# EAGLE design FLEXIBOARD (EAGLE 7.6.0)
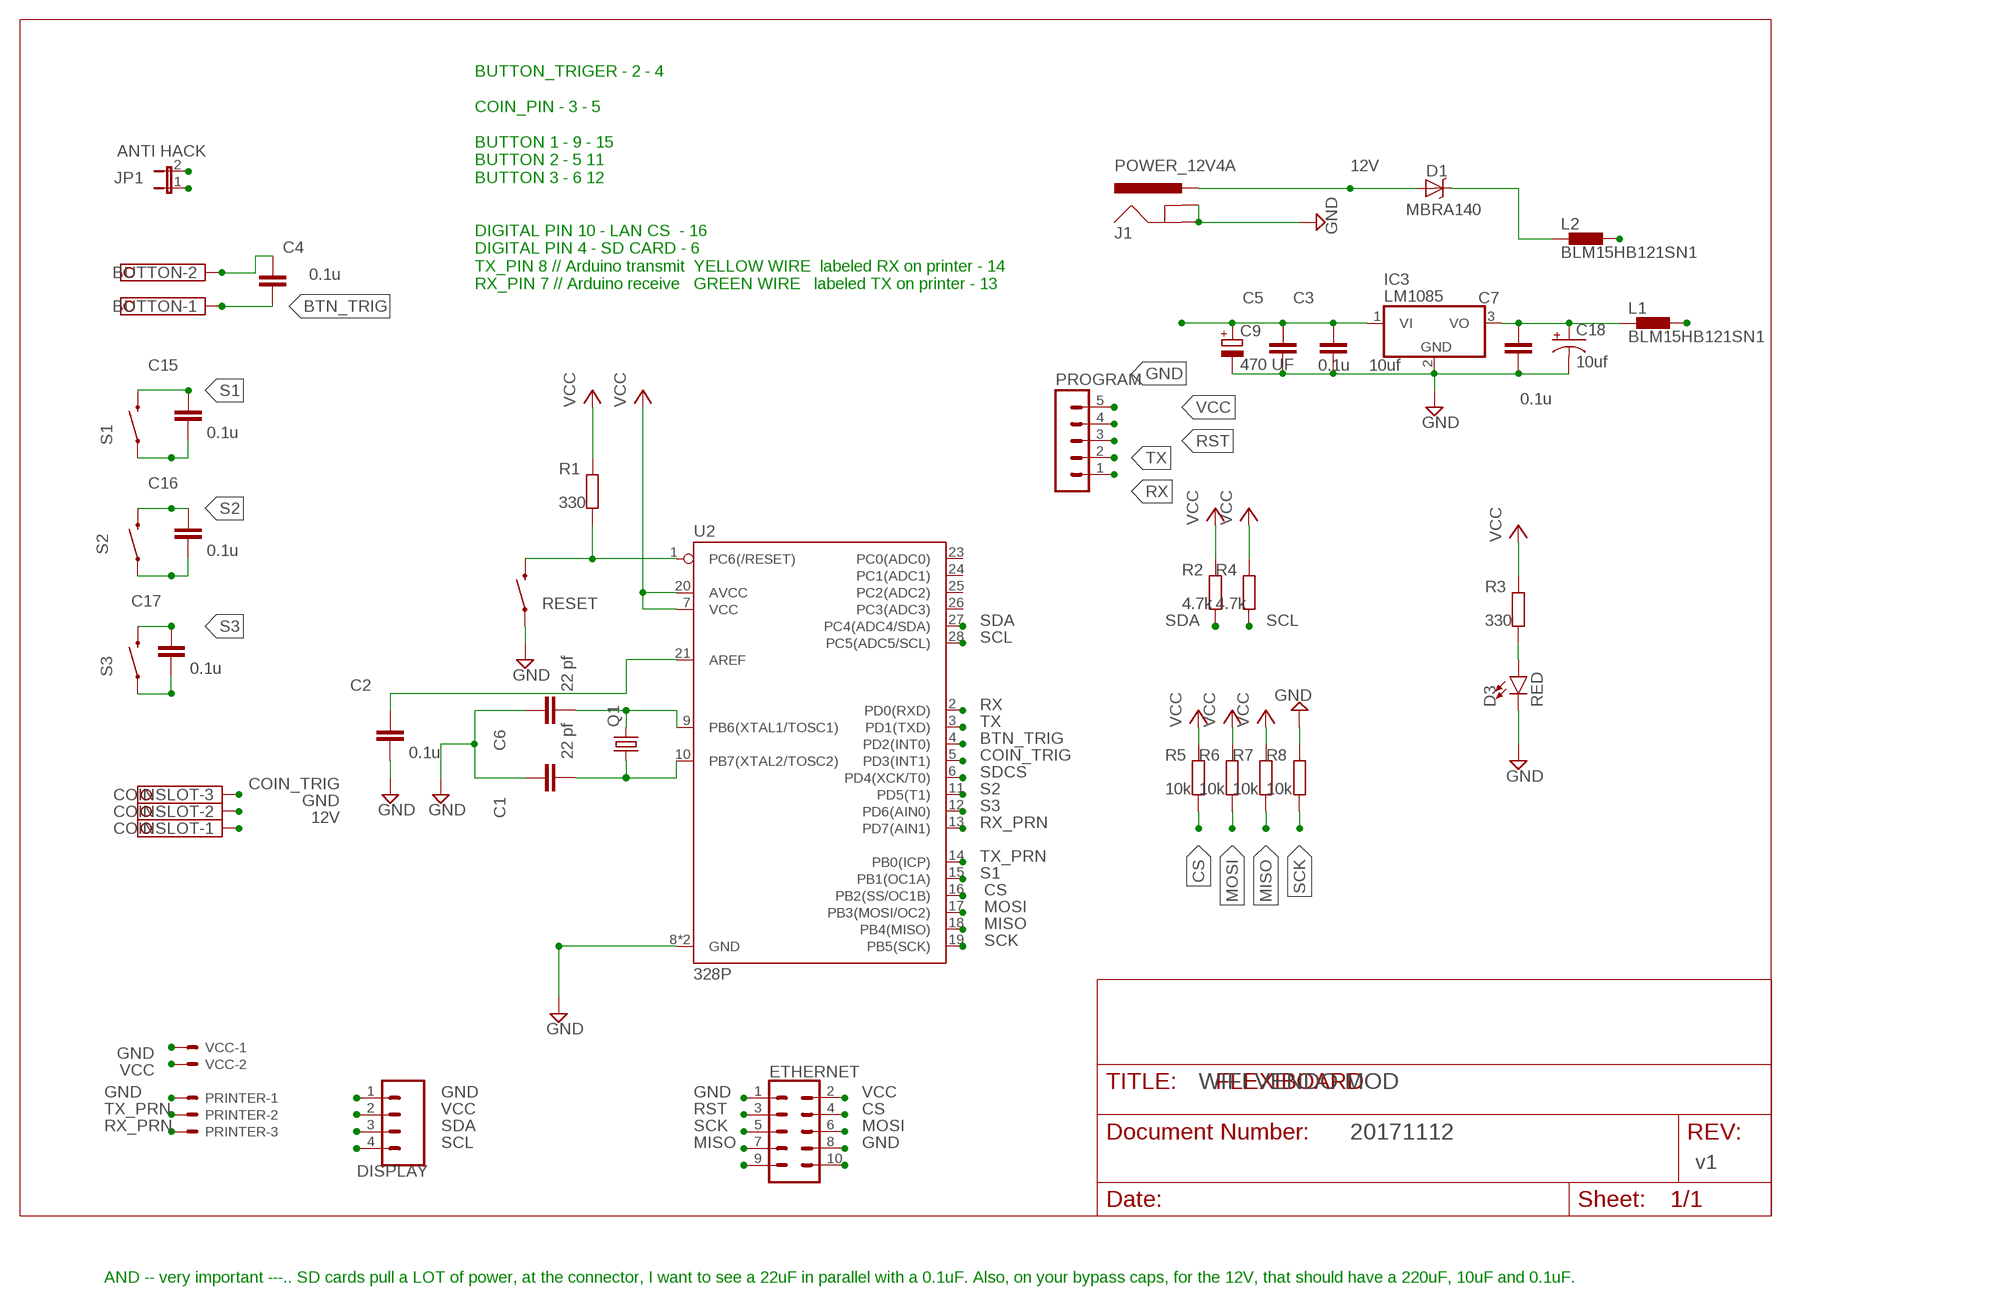
[diagram p0: schematic, sheet 1]

## Parts
BUTTON  TERMINAL-BLOCK-3.5MM-2-PIN-LONG-PAD  [TERMINAL-BLOCK-2-PIN-3.5MM-LONG-PAD]
C1  22 pf  C-EU050-024X044  [C050-024X044]
C2  0.1u  C-EU050-024X044  [C050-024X044]
C3  10uf  C-EU050-024X044  [C050-024X044]
C4  0.1u  C-EU050-024X044  [C050-024X044]
C5  0.1u  C-EU050-024X044  [C050-024X044]
C6  22 pf  C-EU050-024X044  [C050-024X044]
C7  0.1u  C-EU050-024X044  [C050-024X044]
C9  470 UF  CPOL-EUE2.5-7  [E2,5-7]
C15  0.1u  C-EU050-024X044  [C050-024X044]
C16  0.1u  C-EU050-024X044  [C050-024X044]
C17  0.1u  C-EU050-024X044  [C050-024X044]
C18  10uf  CPOL-USE2-5  [E2-5]
COINSLOT  TERMINAL-BLOCK-3.5MM-3-PIN-LONG-PAD  [TERMINAL-BLOCK-3-PIN-3.5MM-LONG-PAD]
D1  MBRA140  DIODE-SCHOTTKY_  [SMA-DIODE]
D3  RED  LED5MM  [LED_5MM]
DISPLAY  M04PTH  [1X04]
ETHERNET  CONN_05X2PTH  [2X5]
IC3  LM1085  LM2937  [TO263-3]
J1  POWER_12V4A  POWER_JACKPTH  [POWER_JACK_PTH]
JP1  ANTI HACK  JUMPER-2SMD-NO  [SJ_2S-NO]
L1  BLM15HB121SN1  [0402]
L2  BLM15HB121SN1  [0402]
PRINTER  JST-XH-03-PIN-LONG-PAD  [JST-XH-03-PACKAGE-LONG-PAD]
PROGRAM  MA05-1  [MA05-1]
Q1  CRYSTALSM49  [SM49]
R1  330  R-EU_0204/7  [0204/7]
R2  4.7k  R-EU_0204/7  [0204/7]
R3  330  R-EU_0204/7  [0204/7]
R4  4.7k  R-EU_0204/7  [0204/7]
R5  10k  R-EU_0204/7  [0204/7]
R6  10k  R-EU_0204/7  [0204/7]
R7  10k  R-EU_0204/7  [0204/7]
R8  10k  R-EU_0204/7  [0204/7]
RESET  SWITCH-MOMENTARY-2PTH_EZ  [TACTILE-PTH-EZ]
S1  SWITCH-MOMENTARY-2PTH_EZ  [TACTILE-PTH-EZ]
S2  SWITCH-MOMENTARY-2PTH_EZ  [TACTILE-PTH-EZ]
S3  SWITCH-MOMENTARY-2PTH_EZ  [TACTILE-PTH-EZ]
U2  328P  ATMEGA328P_PDIP  [DIP28]
VCC  JST-XH-02-PIN-LONG-PAD  [JST-XH-02-PACKAGE-LONG-PAD]

## Nets
12V: COINSLOT.1 D1.A J1.PWR
BTN_TRIG: BUTTON.1 C4.2 U2.4(PD2(INT0))
COIN_TRIG: COINSLOT.3 U2.5(PD3(INT1))
CS: ETHERNET.4 R5.1 U2.16(PB2(SS/OC1B))
GND: BUTTON.2 C1.1 C2.2 C3.2 C4.1 C5.2 C6.1 C7.2 C9.- C15.2 C16.2 C17.2 C18.- COINSLOT.2 D3.K(C) DISPLAY.1 ETHERNET.1 ETHERNET.8 IC3.2(GND) J1.GND J1.GNDBREAK PRINTER.1 PROGRAM.5 R8.2 RESET.1 S1.1 S2.1 S3.1 U2.8(GND) U2.22(GND) VCC.1
INPUT: C3.1 C5.1 C9.+ IC3.1(VI) L2.2
MISO: ETHERNET.7 R7.1 U2.18(PB4(MISO))
MOSI: ETHERNET.6 R6.1 U2.17(PB3(MOSI/OC2))
N$1: C6.2 Q1.2 U2.9(PB6(XTAL1/TOSC1))
N$2: C1.2 Q1.1 U2.10(PB7(XTAL2/TOSC2))
N$3: D1.C L2.1
N$4: C7.1 C18.+ IC3.3(VO) L1.1
N$6: D3.A R3.1
N$7: C2.1 U2.21(AREF)
N$10: ETHERNET.10
N$11: ETHERNET.9
RST: ETHERNET.3 PROGRAM.3 R1.1 RESET.3 U2.1(PC6(/RESET))
RX: JP1.2 PROGRAM.1 U2.2(PD0(RXD))
RX_PRN: PRINTER.3 U2.13(PD7(AIN1))
S1: C15.1 S1.3 U2.15(PB1(OC1A))
S2: C16.1 S2.3 U2.11(PD5(T1))
S3: C17.1 S3.3 U2.12(PD6(AIN0))
SCK: ETHERNET.5 R8.1 U2.19(PB5(SCK))
SCL: DISPLAY.4 R4.1 U2.28(PC5(ADC5/SCL))
SDA: DISPLAY.3 R2.1 U2.27(PC4(ADC4/SDA))
SDCS: U2.6(PD4(XCK/T0))
TX: JP1.1 PROGRAM.2 U2.3(PD1(TXD))
TX_PRN: PRINTER.2 U2.14(PB0(ICP))
VCC: DISPLAY.2 ETHERNET.2 L1.2 PROGRAM.4 R1.2 R2.2 R3.2 R4.2 R5.2 R6.2 R7.2 U2.7(VCC) U2.20(AVCC) VCC.2
Unconnected: U2.23(PC0(ADC0)) U2.24(PC1(ADC1)) U2.25(PC2(ADC2)) U2.26(PC3(ADC3))

## Notes on the sheet
- BUTTON_TRIGER - 2 - 4
  
  COIN_PIN - 3 - 5
  
  BUTTON 1 - 9 - 15
  BUTTON 2 - 5 11
  BUTTON 3 - 6 12
  
  
  DIGITAL PIN 10 - LAN CS  - 16
  DIGITAL PIN 4 - SD CARD - 6
  TX_PIN 8 // Arduino transmit  YELLOW WIRE  labeled RX on printer - 14
  RX_PIN 7 // Arduino receive   GREEN WIRE   labeled TX on printer - 13
- WIFI VENDO MOD
- 20171112
- SCL
- v1
- AND -- very important ---.. SD cards pull a LOT of power, at the connector, I want to see a 22uF in parallel with a 0.1uF. Also, on your bypass caps, for the 12V, that should have a 220uF, 10uF and 0.1uF.

## Library data of the parts
BUTTON = Rembrandt Electronics - Terminal Block 3-5mm v1-0:TERMINAL-BLOCK-3.5MM-2-PIN: Terminal Block 3.5mm Pitch: 3,5 mm Number of pins: 2 Created by Rembrandt Electronics www.rembrandtelectronics.com
C1-C7 C15-C17 = resistor:C-EU: CAPACITOR, European symbol
C9 = rcl:CPOL-EU: POLARIZED CAPACITOR, European symbol
C18 = resistor:CPOL-US: POLARIZED CAPACITOR, American symbol
COINSLOT = Rembrandt Electronics - Terminal Block 3-5mm v1-0:TERMINAL-BLOCK-3.5MM-3-PIN: Terminal Block 3.5mm Pitch: 3,5 mm Number of pins: 3 Created by Rembrandt Electronics www.rembrandtelectronics.com
D1 = SparkFun:DIODE-SCHOTTKY
D3 = SparkFun-LED:LED: LED (Generic) Standard schematic elements and footprints for 5mm, 3mm, 1206, and 0603 sized LEDs. Generic LEDs with no color specified.
DISPLAY = SparkFun-Connectors:M04: Header 4 Standard 4-pin 0.1" header. Use with straight break away headers (SKU : PRT-00116), right angle break away headers (PRT-00553), swiss pins (PRT-00743), machine pins (PRT-00117), and female headers (PRT-00115). Molex polarized connector foot print use with SKU : PRT-08231 with associated crimp pins and housings. 1MM SMD Version SKU: PRT-10208; PROD_ID: CONN-09696
ETHERNET = SparkFun-Connectors:CONN_05X2: Multi connection point. Often used as Generic Header-pin footprint for 0.1 inch spaced/style header connections For AVR SPI programming port, see special device with nice symbol: "AVR_SPI_PROG_5x2.dev" You can populate with any combo of single row headers, but if you'd like an exact match, check these: 2x5 AVR ICSP Male Header <https://www.sparkfun.com/products/778> (PRT-00778) 2x5 Pin Shrouded Header <https://www.sparkfun.com/products/8506> (PRT-08506) On any of the 0.1 inch spaced packages, you can populate with these: Break Away Headers - Straight <https://www.sparkfun.com/products/116> (PRT-00116) Break Away Male Headers - Right Angle <https://www.sparkfun.com/products/553> (PRT-00553) Female Headers <https://www.sparkfun.com/products/115> (PRT-00115) Break Away Headers - Machine Pin <https://www.sparkfun.com/products/117> (PRT-00117) Break Away Female Headers - Swiss Machine Pin <https://www.sparkfun.com/products/743> (PRT-00743) Special note: the shrouded connector mates well with our 5x2 ribbon cables: 2x5 Pin IDC Ribbon Cable <https://www.sparkfun.com/products/8535> (PRT-08535); PROD_ID: CONN-08499; SF_ID: PRT-0778
IC3 = linear:LM2937: LM2937-2.5, LM2937-3.3 400mA and 500mA Voltage Regulators Source: http://cache.national.com/ds/LM/LM2937-2.5.pdf
J1 = SparkFun-Connectors:POWER_JACK: Power Jack This is the standard 5.5mm barrel jack for power. The PTH is the most common, proven, reliable, footprint. The Slot footprint only works if the mill layer is transmitted to the PCB fab house so be warned. Mating wall wart : TOL-00298 (and others); PROD_ID: CONN-08197
JP1 = SparkFun-Retired:JUMPER-2: Jumper Basic 0.1" spaced jumper. Use with breakaway headers.
L1 L2 = inductors:BLM15H: EMIFIL (R) Chip Ferrite Bead for GHz Noise Source: http://www.murata.com/ Ferrite Bead BLM15H.pdf
PRINTER = Rembrandt Electronics - JST XH Connectors v1-0:JST-XH-03-PIN: JST XH Connector 2 Pin Wire to board connector. Pitch: 2,54 mm, (0.100") Number of pins: 3 Created by Rembrandt Electronics www.rembrandtelectronics.com
PROGRAM = con-lstb:MA05-1: PIN HEADER; OC_FARNELL: unknown; OC_NEWARK: unknown
Q1 = crystal:CRYSTAL: CRYSTAL; OC_FARNELL: unknown; OC_NEWARK: unknown
R1-R8 = resistor:R-EU_: RESISTOR, European symbol
RESET S1-S3 = SparkFun-Electromechanical:SWITCH-MOMENTARY-2: Various NO switches- pushbuttons, reed, etc
U2 = SparkFun-IC-Microcontroller:ATMEGA328P_PDIP: Atmel 328P Through hole ATMEGA328P uC used in the Arduino 32kb flash, 1k EEPROM, 2k SRAM Datasheet <http://www.sparkfun.com/datasheets/Components/SMD/ATMega328.pdf> SparkFun Products Storefront component: AVR 28 Pin 20MHz 32K 6A/D - ATMega328P <https://www.sparkfun.com/products/9061> (COM-09061) SparkFun Simon Says - Through-Hole Soldering Kit <https://www.sparkfun.com/products/10547> (KIT-10547) SparkFun Learn to Solder - Simon Says <https://www.sparkfun.com/products/13708> (KIT-13708) SparkFun BigTime Watch Kit <https://www.sparkfun.com/products/11734> (KIT-11734) SparkFun ClockIt <https://www.sparkfun.com/products/10930> (KIT-10930) SparkFun Serial Enabled LCD Kit <https://www.sparkfun.com/products/10097> (LCD-10097) SparkFun Simon Tilts - Through Hole Soldering Kit <https://www.sparkfun.com/products/12634> (KIT-12634) SparkFun Frequency Counter Kit <https://www.sparkfun.com/products/10140> (KIT-10140) FabFM Radio Kit <https://www.sparkfun.com/products/11043> (KIT-11043) SparkFun Binary Blaster Kit <https://www.sparkfun.com/products/12037> (KIT-12037) SparkFun Metro-Gnome <https://www.sparkfun.com/products/9236> (KIT-09236) ATmega328 with Arduino Optiboot (Uno) <https://www.sparkfun.com/products/10524> (DEV-10524); PROD_ID: IC-09136
VCC = Rembrandt Electronics - JST XH Connectors v1-0:JST-XH-02-PIN: JST XH Connector 2 Pin Wire to board connector. Pitch: 2,54 mm, (0.100") Number of pins: 2 Created by Rembrandt Electronics www.rembrandtelectronics.com

## Board
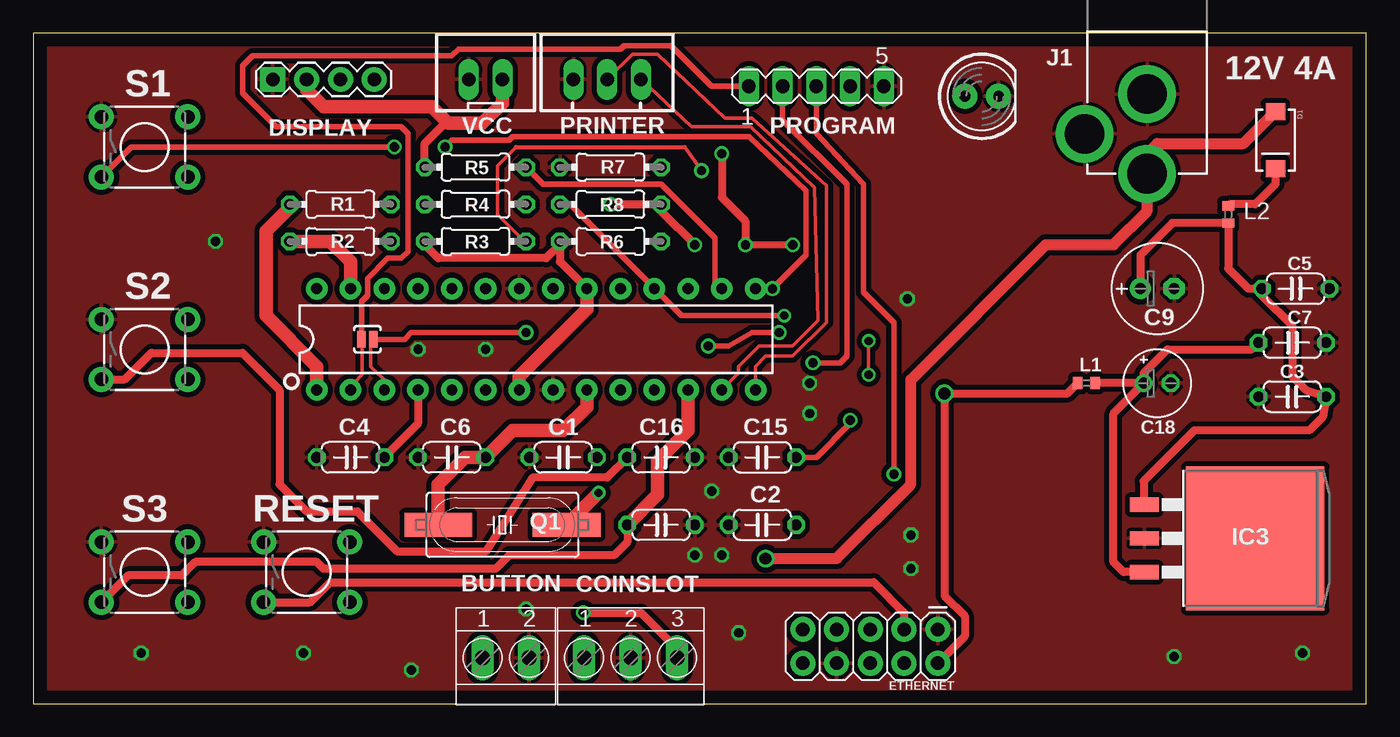
[diagram p1: board, top side]
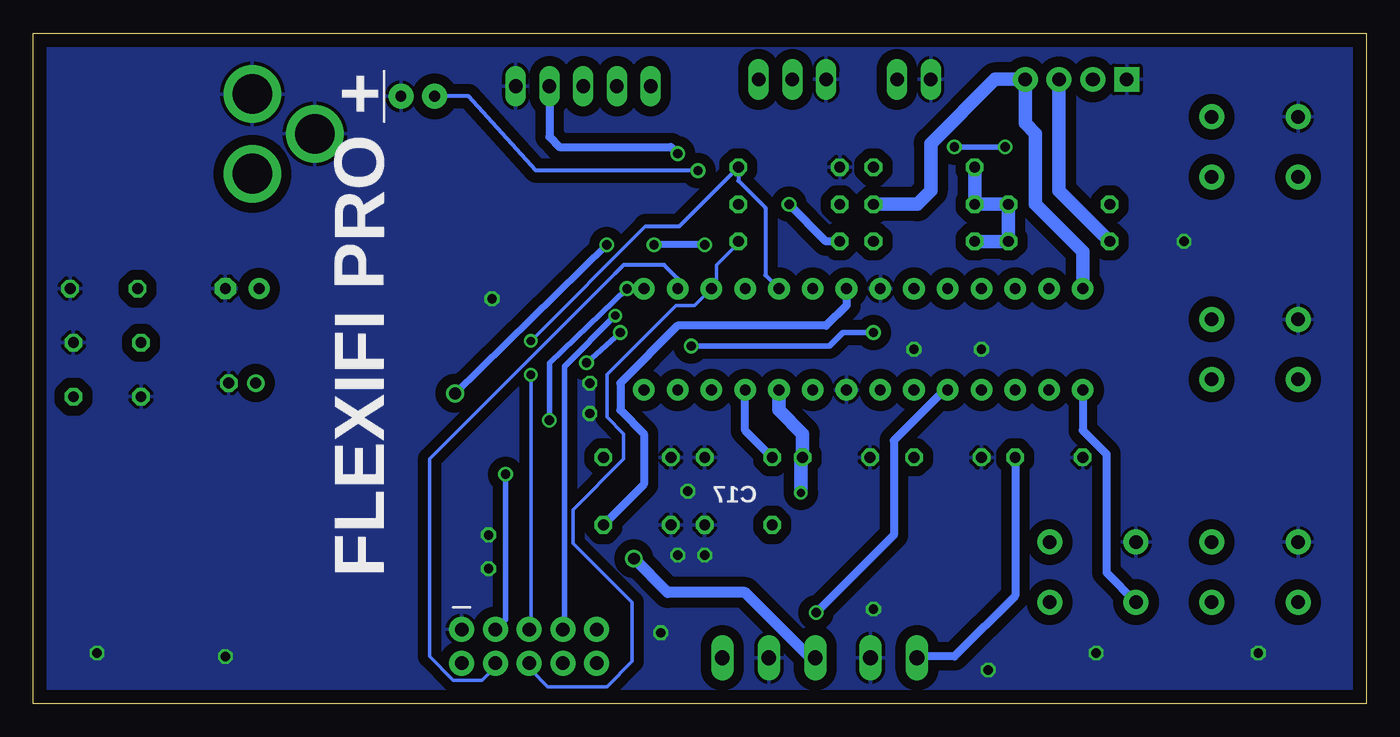
[diagram p2: board, bottom side, seen from below]

Size 100.31 x 50.47 mm. Coordinates in mm from the lower left corner, seen from the top.
Outline: 0,0 100.31,0 100.31,50.47 0,50.47 0,0
Copper layers (1*16): Top 0.035mm / dielectric 1.5mm / Bottom 0.035mm
Design rules "default": minimum track width 10mil, minimum drill 24mil, track to track 8mil, track to pad 8mil, pad to pad 8mil, via to via 8mil, smd to smd 8mil, copper to edge 40mil, drill to drill 8mil, minimum pad ring 10mil, minimum via ring 8mil, stop-mask expansion 4mil, vias tented up to drill 0mil, thermal gap 10mil

### Footprints (pad centres in the part's own frame; a part is rotated, then mirrored left to right if it is on the bottom)
TERMINAL-BLOCK-2-PIN-3.5MM-LONG-PAD = drill 1.1 pad 1.7 long: 1 -1.75,-0.1; 2 1.75,-0.1
C050-024X044 = drill 0.813 octagon: 1 -2.54,0; 2 2.54,0
E2,5-7 = drill 0.813 pad 1.6: + -1.27,0 | drill 0.813 pad 1.6 octagon: - 1.27,0
E2-5 = drill 0.813 pad 1.27: + -1.016,0 | drill 0.813 pad 1.27 octagon: - 1.016,0
TERMINAL-BLOCK-3-PIN-3.5MM-LONG-PAD = drill 1.1 pad 1.7 long: 1 -3.5,-0.1; 2 0,-0.1; 3 3.5,-0.1
SMA-DIODE = smd 1.27 x 1.47: A -2.15,0; C 2.15,0
LED_5MM = drill 0.813 pad 1.88: A -1.27,0; K 1.27,0
1X04 = drill 1.016 pad 1.88 square: 1 0,0 | drill 1.016 pad 1.88: 2 2.54,0; 3 5.08,0; 4 7.62,0
2X5 = drill 1.016 pad 1.88: 1 0,0; 2 0,2.54; 3 2.54,0; 4 2.54,2.54; 5 5.08,0; 6 5.08,2.54; 7 7.62,0; 8 7.62,2.54; 9 10.16,0; 10 10.16,2.54
TO263-3 = smd 1.067 x 2.159: 1 -2.54,-5.791; 2 0,-5.791; 3 2.54,-5.791 | smd 10.8 x 10.41: TAB 0,2.54
POWER_JACK_PTH = drill 2.997 pad 4.318: GND 0,7.7; GNDBREAK 4.7,10.7; PWR 0,13.7
SJ_2S-NO = smd 0.635 x 1.27: 1 -0.45,0; 2 0.45,0
0402 = smd 0.7 x 0.9: 1 -0.65,0; 2 0.65,0
JST-XH-03-PACKAGE-LONG-PAD = drill 1.016 long: 1 -2.54,0; 2 0,0; 3 2.54,0
MA05-1 = drill 1.016 long: 1 -5.08,0; 2 -2.54,0; 3 0,0; 4 2.54,0; 5 5.08,0
SM49 = smd 5.08 x 1.778: 1 -4.826,0; 2 4.826,0
0204/7 = drill 0.813 octagon: 1 -3.81,0; 2 3.81,0
TACTILE-PTH-EZ = drill 1.016 pad 1.88: 1 -3.251,2.261; 2 3.251,2.261; 3 -3.251,-2.261; 4 3.251,-2.261
DIP28 = drill 0.813 pad 1.626: 1 -16.51,-3.81; 2 -13.97,-3.81; 3 -11.43,-3.81; 4 -8.89,-3.81; 5 -6.35,-3.81; 6 -3.81,-3.81; 7 -1.27,-3.81; 8 1.27,-3.81; 9 3.81,-3.81; 10 6.35,-3.81; 11 8.89,-3.81; 12 11.43,-3.81; 13 13.97,-3.81; 14 16.51,-3.81; 15 16.51,3.81; 16 13.97,3.81; 17 11.43,3.81; 18 8.89,3.81; 19 6.35,3.81; 20 3.81,3.81; 21 1.27,3.81; 22 -1.27,3.81; 23 -3.81,3.81; 24 -6.35,3.81; 25 -8.89,3.81; 26 -11.43,3.81; 27 -13.97,3.81; 28 -16.51,3.81
JST-XH-02-PACKAGE-LONG-PAD = drill 1.016 long: 1 -1.27,0; 2 1.27,0

### Placement (x,y rotation side)
BUTTON  35.56,3.56 0 top
C1  39.88,18.54 0 top
C2  54.86,13.46 180 top
C3  94.74,23.11 180 top
C4  23.88,18.54 0 top
C5  95,31.24 0 top
C6  31.5,18.54 0 top
C7  94.74,27.18 0 top
C9  84.58,31.24 0 top
C15  54.86,18.54 180 top
C16  47.24,18.54 0 top
C17  47.24,13.46 0 top
C18  84.58,24.13 0 top
COINSLOT  44.96,3.56 0 top
D1  93.47,42.42 270 top
D3  71.37,45.72 0 top
DISPLAY  18.03,46.99 0 top
ETHERNET  68.07,5.59 180 top
IC3  89.41,12.45 270 top
J1  83.82,53.59 180 top
JP1  25.15,27.43 180 top
L1  79.25,24.13 180 top
L2  89.92,36.83 270 top
PRINTER  43.18,46.99 0 top
PROGRAM  58.93,46.48 0 top
Q1  35.31,13.46 180 top
R1  23.11,37.59 0 top
R2  23.11,34.8 0 top
R3  33.27,34.8 180 top
R4  33.27,37.59 180 top
R5  33.27,40.39 180 top
R6  43.43,34.8 180 top
R7  43.43,37.59 0 top
R8  43.43,40.39 180 top
RESET  20.57,9.91 0 top
S1  8.38,41.91 0 top
S2  8.38,26.67 0 top
S3  8.38,9.91 0 top
U2  37.85,27.43 0 top
VCC  34.04,46.99 0 top

### Tracks (layer width: path | path; a pad name or v marks a point on that pad's centre or on a via)
12V  (via drill 0.9 pad 1.02)
  Top 0.813: v55.12,10.92 60.45,10.92 66.04,16.51 66.04,24.38 76.2,34.54 81.28,34.54 83.82,37.08 J1.PWR 83.82,41.4 84.58,42.16 91.07,42.16 D1.A
  Bottom 0.813: COINSLOT.1 41.81,3.46 46.74,8.38 52.58,8.38 v55.12,10.92
BTN_TRIG
  Top 0.61: U2.4 28.96,21.08 C4.2
  Bottom 0.61: C4.2 26.42,8.13 30.99,3.56 33.71,3.56 BUTTON.1
COIN_TRIG  (via drill 0.7)
  Top 0.61: v41.4,6.86 45.72,6.86 48.51,4.06 48.51,3.51 COINSLOT.3
  Bottom 0.61: U2.5 31.75,23.62 35.56,19.81 35.56,12.7 v41.4,6.86
CS
  Top 0.406: R5.1 38.35,39.12 47.24,39.12 51.31,35.05 51.31,31.75 U2.16
  Bottom 0.254: 56.52,32.39 70.48,18.41 70.48,3.56 68.71,1.78 66.55,1.78 65.53,2.79 ETHERNET.4
  Bottom 0.305: U2.16 51.82,32 52.83,33.02 55.88,33.02 56.52,32.39
GND  (via drill 0.7)
  other vias: 13.72,34.8 37.08,7.11 28.45,2.54 51.82,11.18 49.78,11.18 51.05,16 58.42,21.84 58.42,24.13 8.13,3.81 20.32,3.81 95.5,3.81 85.85,3.56 66.04,10.16 66.04,12.7 65.79,30.48 28.96,26.67 34.04,26.67 53.09,5.33
  pour Bottom (isolate 0.762): 0.25,-0.25 100.58,0 100.33,50.04 0,50.8
  pour Top (isolate 0.381): 0,50.8 0,0.25 8.89,-0.25 100.33,0 100.33,50.55
INPUT
  Top 0.61: IC3.1 83.57,15.04 83.57,16.76 87.38,20.57 96.01,20.57 97.03,21.59 C3.1 95.76,23.62 94.74,24.64 94.74,28.45 92.46,30.73 C5.1 91.44,31.24 89.92,32.77 L2.2 85.71,36.18 83.31,33.78 C9.+
MISO  (via drill 0.61)
  Top 0.406: R7.1 40.39,37.59 U2.18 48.77,29.21 v56.52,29.21
  Bottom 0.406: ETHERNET.7 60.33,5.71 60.33,25.4 v56.52,29.21
MOSI
  Bottom 0.254: R6.1 47.62,34.29 48.9,33.02 48.9,31.75 U2.17 50.55,29.97 51.94,29.97 57.15,24.77 57.15,21.59 55.88,20.32 55.88,18.41 59.69,14.61 59.69,12.06 55.24,7.62 55.24,3.17 57.15,1.27 61.59,1.27 62.87,2.54 ETHERNET.6
N$1
  Top 1.016: U2.9 41.66,22.35 39.88,20.57 36.07,20.57 C6.2 32.51,18.54 30.48,16.51 Q1.2
N$2  (via drill 0.61)
  Top 1.016: Q1.1 v42.55,15.88
  Bottom 1.016: v42.55,15.88 42.55,18.41 C1.2 42.42,20.32 44.2,22.1 U2.10
N$3
  Top 0.61: D1.C 93.47,39.12 91.95,37.59 90.03,37.59 L2.1
N$4
  Top 0.61: C18.+ L1.1 | IC3.3 82.04,9.91 81.28,10.67 81.28,21.84 C18.+ | C18.+ 83.57,24.89 85.34,26.67 91.69,26.67 C7.1
N$6  (via drill 0.7)
  Top 0.254: R3.1 36.83,34.92 34.92,36.83 34.92,40.51 36.32,41.91
  Top 0.305: 36.32,41.91 49.02,41.91 v50.29,40.13
  Bottom 0.305: D3.A 67.56,45.72 62.48,40.13 v50.29,40.13
N$7
  Bottom 0.61: U2.21 39.12,29.97 40.64,28.45 51.82,28.45 56.13,24.13 56.13,22.1 54.36,20.32 54.36,16.51 C2.1
RST  (via drill 0.7)
  Top 0.254: 65.41,5.71 ETHERNET.3
  Top 0.406: PROGRAM.3 58.93,42.93 62.48,39.12 62.48,30.99 64.77,28.7 v64.77,17.27
  Top 0.61: RESET.3 20.85,7.64 22.35,9.14 63.25,9.14 65.53,6.86 ETHERNET.3
  Top 1.016: R1.1 19.3,37.34 17.53,35.56 17.53,29.21 21.34,25.4 U2.1
  Bottom 0.406: v64.77,17.27 64.77,6.35 ETHERNET.3
  Bottom 0.61: U2.1 21.34,20.57 19.56,18.8 19.56,9.88 RESET.3
RX
  Top 0.254: JP1.2 24.77,27.3 24.77,24.77 24.13,24.13 U2.2
  Top 0.406: JP1.2 24.7,30.28 25.15,30.73 25.15,32 26.67,33.53 27.69,33.53 28.19,34.04 28.19,42.93 27.69,43.43 18.29,43.43 15.75,45.97 15.75,48.01 16.51,48.77 31.5,48.77 32,49.28 44.2,49.28 44.45,49.53 48.01,49.53 51.05,46.48 PROGRAM.1
RX_PRN
  Top 0.254: PRINTER.3 49.53,43.43 53.98,43.43 58.8,38.86 59.05,28.83 57.15,26.92 54.61,26.92 53.09,25.4 53.09,24.89 U2.13
S1  (via drill 0.7)
  Top 0.406: U2.15 v55.63,31.24 58.17,33.78 58.17,38.61 53.85,42.67 36.07,42.67 35.81,42.42 31.5,42.42 v30.99,41.91 | v27.18,41.91 7.39,41.91 S1.3 | v61.47,21.34 61.47,21.08 58.93,18.54 C15.1
  Bottom 0.406: v30.99,41.91 v27.18,41.91 | v55.63,31.24 61.47,25.65 v61.47,21.34
S2
  Top 0.61: C16.1 43.18,17.02 37.59,17.02 34.04,11.43 27.43,11.43 24.38,14.48 20.57,14.48 18.54,16.51 18.54,23.62 15.75,26.42 8.89,26.42 6.88,24.41 S2.3
  Bottom 0.61: C16.1 46.74,20.57 U2.11
S3
  Top 0.61: C17.1 44.7,12.19 43.69,11.18 35.81,11.18 34.8,10.16 21.84,10.16 21.34,10.67 12.19,10.67 11.18,9.65 7.14,9.65 S3.3
  Top 1.016: U2.12 49.28,20.57 46.99,18.29 46.99,15.75 C17.1
SCK  (via drill 0.61)
  Top 0.254: v62.87,27.3 v62.87,24.77
  Bottom 0.254: v62.87,24.77 62.87,5.71 ETHERNET.5 | 54.23,35.94 v62.87,27.3
  Bottom 0.305: 54.23,35.94 51.69,35.94 R8.1 47.24,39.37 45.21,37.34 45.21,32.26 U2.19
SCL
  Bottom 1.016: U2.28 21.34,34.04 24.89,37.59 24.89,42.93 25.65,43.69 DISPLAY.4 27.94,46.99 32.77,42.16 32.77,38.61 33.78,37.59 R4.1
SDA
  Top 1.016: R2.1 22.35,34.8 23.88,33.27 U2.27
  Bottom 1.016: DISPLAY.3 23.11,38.61 R2.1
TX  (via drill 0.7)
  Top 0.254: JP1.1 25.4,27.3 25.4,25.4 26.67,24.13 U2.3
  Top 0.406: JP1.1 27.94,27.43 28.45,27.94 v37.08,27.94 | v50.8,26.92 52.32,26.92 54.1,27.94 v56.13,27.94 | v58.67,25.65 60.71,25.65 61.21,26.16 61.21,39.12 56.39,43.94 PROGRAM.2
  Bottom 0.406: v37.08,27.94 39.37,27.94 40.39,26.92 v50.8,26.92 | v56.13,27.94 v58.67,25.65
TX_PRN
  Top 0.254: PRINTER.2 45.09,48.89 46.99,48.89 52.07,44.07 54.1,44.07 59.69,38.99 59.69,28.7 57.15,26.16 55.12,26.16 54.36,25.4 U2.14
VCC  (via drill 0.7, 0.9)
  Top 0.508: v53.59,34.54 v57.15,34.54
  Top 0.61: R3.2 29.46,34.54 30.48,33.53 38.61,33.53 39.62,34.54 R6.2 39.62,33.27 U2.20 | v43.43,37.59 R7.2 47.24,37.08 v49.78,34.54 | L1.2 77.84,23.37 v68.58,23.37 68.58,8.13 70.1,6.6 70.1,5.08 ETHERNET.2 | R5.2 29.46,42.16 31.11,43.81 | v51.82,41.4 51.82,38.1 53.59,36.32 v53.59,34.54
  Top 1.016: U2.20 41.66,29.72 36.58,24.64 U2.7 | DISPLAY.2 20.57,46.23 21.84,44.96 29.97,44.96 31.11,43.81 31.24,43.69 33.78,43.69 35.31,45.21 VCC.2
  Bottom 0.508: v49.78,34.54 v53.59,34.54 | v57.15,34.54 v68.58,23.37
  Bottom 0.61: R6.2 40.64,34.8 v43.43,37.59 | PROGRAM.4 61.47,42.67 60.71,41.91 52.32,41.91 v51.82,41.4
  Bottom 1.016: R3.2 R2.2 R1.2 R4.2 R5.2

### Text on the board
tPlace: 12V 4A
bPlace: FLEXIFI PRO +